# Altium schematic sheet analog filterung.SchDoc: Sheetname
size A4; Date: 05.10.2017; CheckedBy: UNCHECKED; Author: Team Member; Organization: Team Starcraft e.V.; Address1: Oberweg 2; Address2: 98704 Langewiesen; Revision: xx.xx; SheetNumber: 1; SheetTotal: 5; Rules: TODO; ProjectName: Projekt
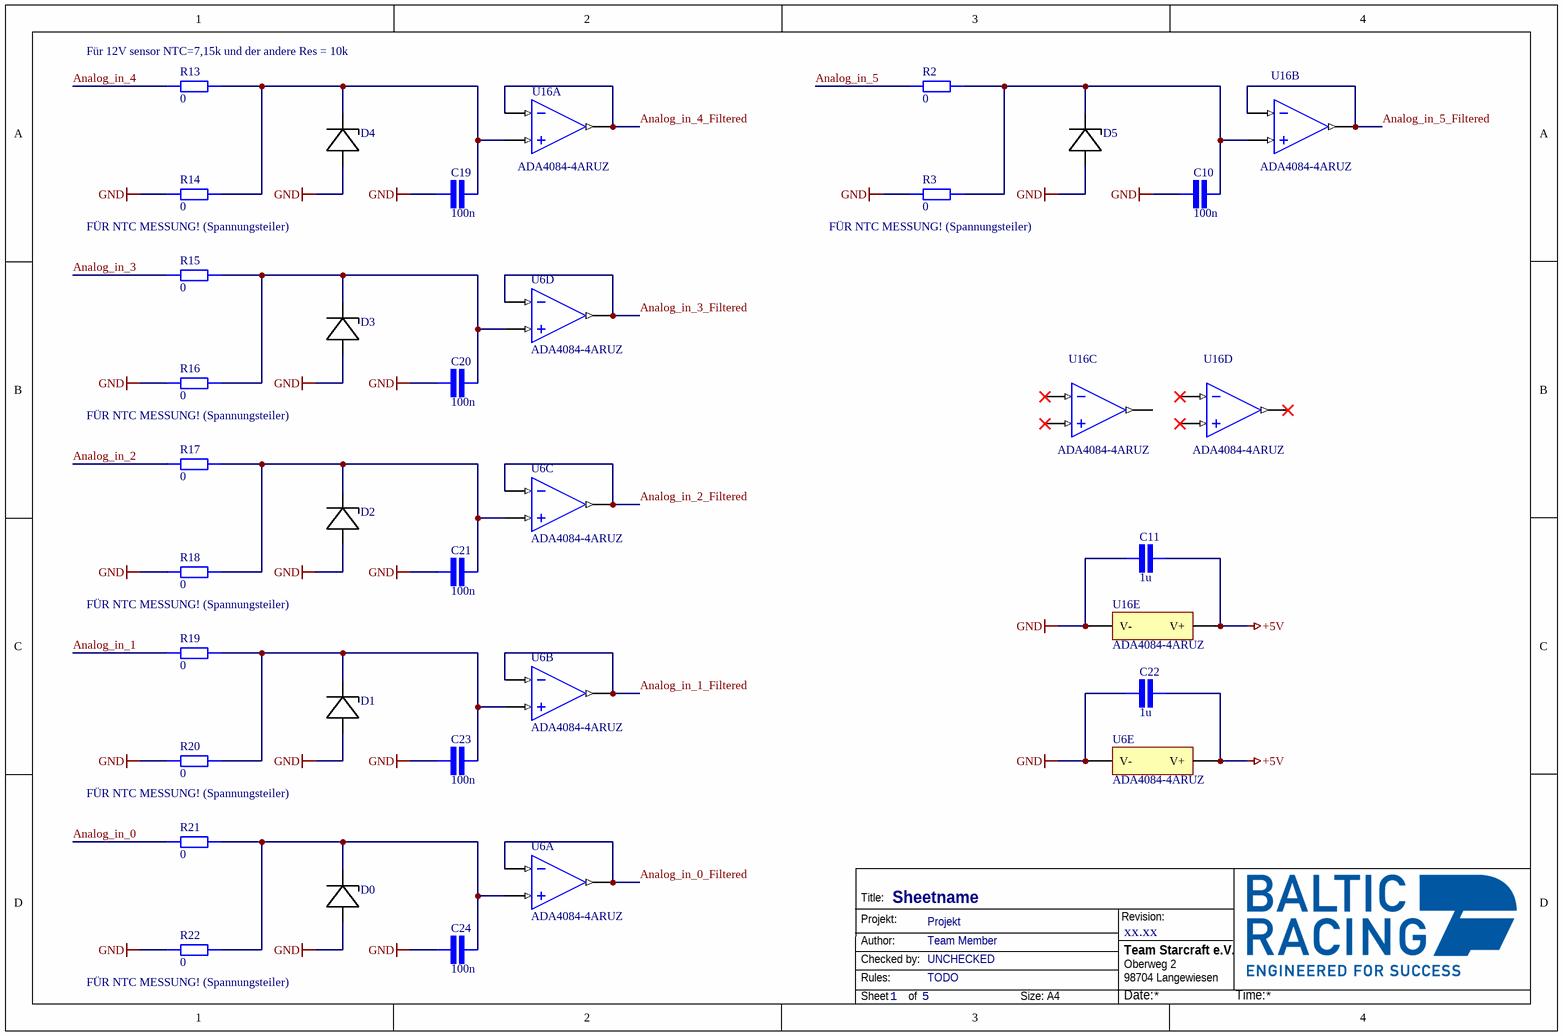
[diagram p0: analog filterung.SchDoc]

## Parts
C10  value 100n  [CAP 0603/1608]  (hidden comment: SMD Capacitor)
C11  value 1u  [CAP 0603/1608]  (hidden comment: SMD Capacitor)
C19  value 100n  [CAP 0603/1608]  (hidden comment: SMD Capacitor)
C20  value 100n  [CAP 0603/1608]  (hidden comment: SMD Capacitor)
C21  value 100n  [CAP 0603/1608]  (hidden comment: SMD Capacitor)
C22  value 1u  [CAP 0603/1608]  (hidden comment: SMD Capacitor)
C23  value 100n  [CAP 0603/1608]  (hidden comment: SMD Capacitor)
C24  value 100n  [CAP 0603/1608]  (hidden comment: SMD Capacitor)
D0  MMBZ4625-HE3-08  [SOT95P248X115-3N]  (value not drawn)
D1  MMBZ4625-HE3-08  [SOT95P248X115-3N]  (value not drawn)
D2  MMBZ4625-HE3-08  [SOT95P248X115-3N]  (value not drawn)
D3  MMBZ4625-HE3-08  [SOT95P248X115-3N]  (value not drawn)
D4  MMBZ4625-HE3-08  [SOT95P248X115-3N]  (value not drawn)
D5  MMBZ4625-HE3-08  [SOT95P248X115-3N]  (value not drawn)
R2  value 0  [STACKPOLE CSR0603]  (hidden comment: SMD Resistor)
R3  value 0  [STACKPOLE CSR0603]  (hidden comment: SMD Resistor)
R13  value 0  [STACKPOLE CSR0603]  (hidden comment: SMD Resistor)
R14  value 0  [STACKPOLE CSR0603]  (hidden comment: SMD Resistor)
R15  value 0  [STACKPOLE CSR0603]  (hidden comment: SMD Resistor)
R16  value 0  [STACKPOLE CSR0603]  (hidden comment: SMD Resistor)
R17  value 0  [STACKPOLE CSR0603]  (hidden comment: SMD Resistor)
R18  value 0  [STACKPOLE CSR0603]  (hidden comment: SMD Resistor)
R19  value 0  [STACKPOLE CSR0603]  (hidden comment: SMD Resistor)
R20  value 0  [STACKPOLE CSR0603]  (hidden comment: SMD Resistor)
R21  value 0  [STACKPOLE CSR0603]  (hidden comment: SMD Resistor)
R22  value 0  [STACKPOLE CSR0603]  (hidden comment: SMD Resistor)
U6  ADA4084-4ARUZ  [ANALOG_RU14]  (parts A,B,C,D,E of 5)
U16  ADA4084-4ARUZ  [ANALOG_RU14]  (parts A,B,C,D,E of 5)

## Nets
+5V: C11.1 C22.1 U6.4(V+) U16.4(V+)
GND: C10.1 C11.2 C19.1 C20.1 C21.1 C22.2 C23.1 C24.1 D0.A(Anode) D1.A(Anode) D2.A(Anode) D3.A(Anode) D4.A(Anode) D5.A(Anode) R3.2 R14.2 R16.2 R18.2 R20.2 R22.2 U6.11(V-) U16.11(V-)
Analog_in_0: R21.2
Analog_in_0_Filtered: U6.1(OUT_A) U6.2(-IN_A)
Analog_in_1: R19.2
Analog_in_1_Filtered: U6.6(-IN_B) U6.7(OUT_B)
Analog_in_2: R17.2
Analog_in_2_Filtered: U6.8(OUT_C) U6.9(-IN_C)
Analog_in_3: R15.2
Analog_in_3_Filtered: U6.13(-IN_D) U6.14(OUT_D)
Analog_in_4: R13.2
Analog_in_4_Filtered: U16.1(OUT_A) U16.2(-IN_A)
Analog_in_5: R2.2
Analog_in_5_Filtered: U16.6(-IN_B) U16.7(OUT_B)
NetC10_2: C10.2 D5.C(Kathode) R2.1 R3.1 U16.5(+IN_B)
NetC19_2: C19.2 D4.C(Kathode) R13.1 R14.1 U16.3(+IN_A)
NetC20_2: C20.2 D3.C(Kathode) R15.1 R16.1 U6.12(+IN_D)
NetC21_2: C21.2 D2.C(Kathode) R17.1 R18.1 U6.10(+IN_C)
NetC23_2: C23.2 D1.C(Kathode) R19.1 R20.1 U6.5(+IN_B)
NetC24_2: C24.2 D0.C(Kathode) R21.1 R22.1 U6.3(+IN_A)

Not connected (* = marked no-connect by the designer): U16 8(OUT_C) 9(-IN_C)* 10(+IN_C)* 12(+IN_D)* 13(-IN_D)* 14(OUT_D)*

## Notes on the sheet
- (near R13) Für 12V sensor NTC=7,15k und der andere Res = 10k
- FÜR NTC MESSUNG! (Spannungsteiler)
- (near R3) FÜR NTC MESSUNG! (Spannungsteiler)
- (near R22) FÜR NTC MESSUNG! (Spannungsteiler)
- Title:
- Projekt:
- Revision:
- Author:
- Rules:
- Checked by:
- Sheet
- of
- Size:
- A4
- Date:
- Time:

## Library data of the parts
C10 C11 C19-C24 = SMD Capacitor: Capacitor with multiple Footprints
D0-D5 = MMBZ4625-HE3-08: Zener-Diode 5.1 Volt 0.225W 5% AUTO; pin to pad: A>1 C>3; ComponentLink1Description: Mouser; ComponentLink1URL: https://www.mouser.de/ProductDetail/Vishay-Semiconductors/MMBZ4625-HE3-08?qs=ESFF34UzhwghTg091CfyaQ==; ComponentLink2Description: Datasheet; ComponentLink2URL: https://www.mouser.de/datasheet/2/427/VISH_S_A0006718872_1-2569675.pdf
R2 R3 R13-R22 = SMD Resistor: Resistor with multiple footprints
U6 U16 = ADA4084-4ARUZ: 30 V, Low Noise, Rail-to-Rail Input/Output, Low Power Operational Amplifiers